# Altium schematic sheet Power Management.SchDoc
size A4; SheetNumber: 2; SheetTotal: 7
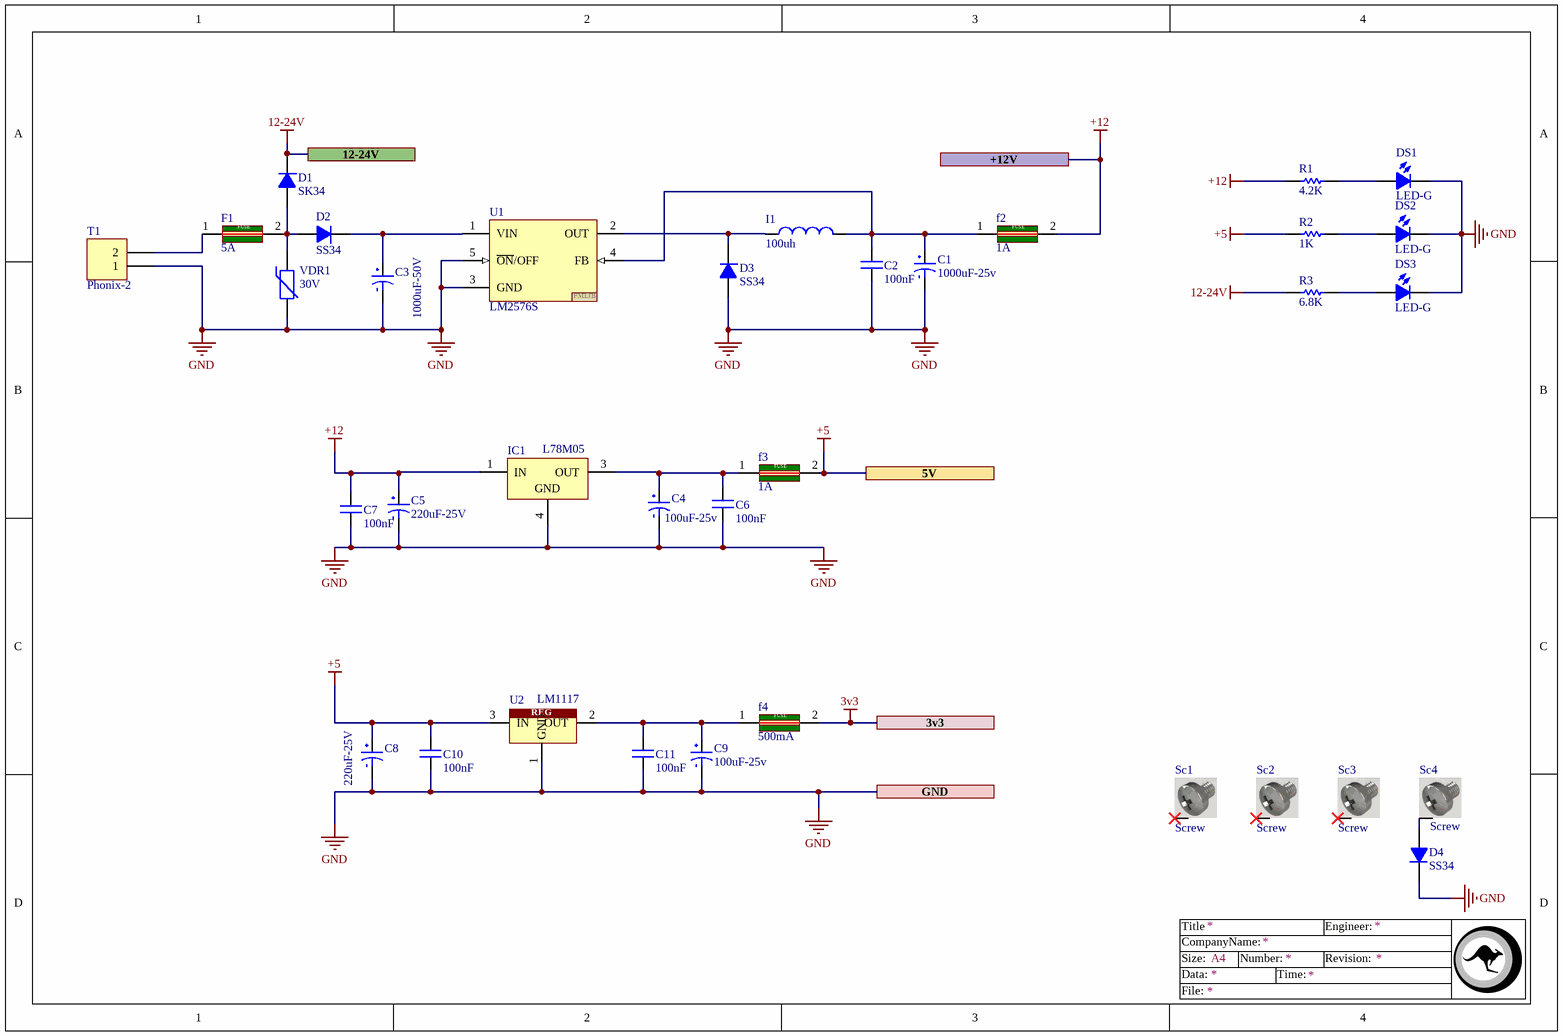
[diagram p0: Power Management.SchDoc]

## Parts
C1  1000uF-25v  [Cap_4mm]
C2  100nF  [CAP1206]
C3  1000uF-50V  [Cap_5mm]
C4  100uF-25v  [Cap_4mm]
C5  220uF-25V  [Cap_4mm]
C6  100nF  [Cap0805]
C7  100nF  [Cap0805]
C8  220uF-25V  [CAPMOL_B]
C9  100uF-25v  [CAPMOL_B]
C10  100nF  [Cap0805]
C11  100nF  [Cap0805]
D1  SK34  [Diod-3A-SMD]
D2  SS34  [Diod-1A-SMD]
D3  SS34  [Diod-1A-SMD]
D4  SS34  [Diod-1A-SMD]
DS1  LED-G  [Led0805]
DS2  LED-G  [Led0805]
DS3  LED-G  [Led0805]
F1  5A  [Fuse SMD]
f2  1A  [1206]
f3  1A  [1206]
f4  500mA  [1206]
I1  100uh  [INDUCTORSquare]
IC1  L78M05  [TO-252]
R1  4.2K  [R0805]
R2  1K  [R0805]
R3  6.8K  [R0805]
Sc1  Screw  [Screw]
Sc2  Screw  [Screw]
Sc3  Screw  [Screw]
Sc4  Screw  [Screw]
T1  Phonix-2  [Phonix-2]
U1  LM2576S  [LM2576S]
U2  LM1117  [DPACK]
VDR1  30V  [Varistor]

## Ports
3v3 (see Dashboard - Multifunctional Probe[1D], Core-ESP32[3D], Ethernet DP[4A], Input - Output[3D]), 5V (see Dashboard - Multifunctional Probe[1D], Core-ESP32[3D], Ethernet DP[4A], Input - Output[3D]), 12-24V (see Dashboard - Multifunctional Probe[1D], Input - Output[3D]), +12V (see Dashboard - Multifunctional Probe[1D], Input - Output[3D]), GND (see Dashboard - Multifunctional Probe[1D], Core-ESP32[3D], Ethernet DP[3D], Input - Output[3D], USB2Serial[2D])

## Nets
3v3: f4.2(OUT) ; port 3v3
12-24V: D1.K R3.2 ; port 12-24V
+5: C8.2 C10.2 f3.2(OUT) R2.2 U2.3(IN) ; port 5V
+12: C5.2 C7.2 f2.2(OUT) IC1.1(IN) R1.2 ; port +12V
GND: C1.1 C2.1 C3.1 C4.1 C5.1 C6.1 C7.1 C8.1 C9.1 C10.1 C11.1 D3.A D4.K DS1.K DS2.K DS3.K IC1.4(GND) T1.1 U1.3(GND) U1.5(~{ON}/OFF) U2.1(GND) VDR1.1 ; port GND
NetC1_2: C1.2 C2.2 f2.1(IN) I1.2 U1.4(FB)
NetC3_2: C3.2 D2.K U1.1(VIN)
NetC4_2: C4.2 C6.2 f3.1(IN) IC1.3(OUT)
NetC9_2: C9.2 C11.2 f4.1(IN) U2.2(OUT)
NetD1_A: D1.A D2.A F1.2(OUT) VDR1.2
NetD3_K: D3.K I1.1 U1.2(OUT)
NetD4_A: D4.A Sc4.S
NetDS1_A: DS1.A R1.1
NetDS2_A: DS2.A R2.1
NetDS3_A: DS3.A R3.1
NetF1_1: F1.1(IN) T1.2

Not connected (* = marked no-connect by the designer): Sc1 S*; Sc2 S*; Sc3 S*

## Notes on the sheet
- Title
- Size:
- Data:
- CompanyName:
- A4
- Number:
- Time:
- Revision:
- Engineer:
- File:
- (in symbol Fuse) FUSE
- (in symbol LM1117) REG
- (in symbol LM2576S) PMLIB

## Library data of the parts
C1 C3-C5 C8 C9 = Cap_P: Polarity
C2 C6 C7 C10 C11 = Cap: Surface mount Capacitor
D1-D4 = Diode
DS1-DS3 = LED
F1 f2-f4 = Fuse
I1 = Inductor: Indicator
IC1 = L78M05: Precision 500mA Regulator
R1-R3 = Resistor
Sc1-Sc4 = Screw: Screw 3mm
T1 = Phonix-2: Connector
U1 = LM2576S: Regulator
U2 = LM1117: Regulator
VDR1 = Varistor